# Altium schematic sheet Fan.SchDoc
size A4; SheetNumber: 4; SheetTotal: 8
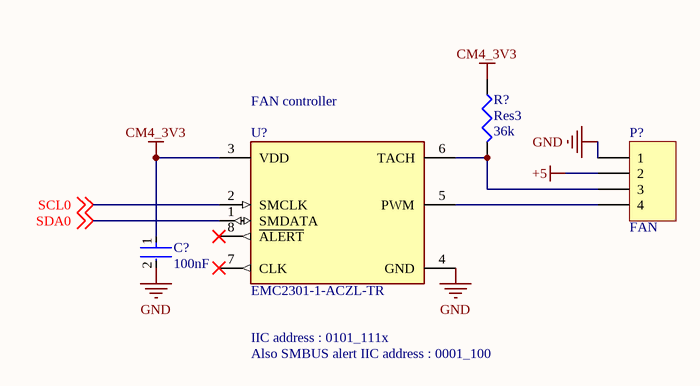
[diagram p0: Fan.SchDoc]

## Parts
C?  100nF  [FP-CC0603-DA-MFG]
P?  FAN  [HDR1X4]
R?  Res3  value 36k  [J1-0603]
U?  EMC2301-1-ACZL-TR  [FP-MO-8-TSSOP-3x3-IPC_C]

## Nets
+5: P?.2
CM4_3V3: C?.1 R?.1 U?.3(VDD)
GND: C?.2 P?.1 U?.4(GND)
SCL0: U?.2(SMCLK) ; off-sheet SCL0
SDA0: U?.1(SMDATA) ; off-sheet SDA0
NetP?_3: P?.3 R?.2 U?.6(TACH)
NetP?_4: P?.4 U?.5(PWM)

Not connected (* = marked no-connect by the designer): U? 7(CLK)* 8(~{ALERT})*

## Notes on the sheet
- (near U?) FAN controller
- IIC address : 0101_111x
- Also SMBUS alert IIC address : 0001_100
- Title:
- Author:
- Approved:
- Size:
- Date:
- Git Hash:
- A4
- Prj:
- SW Version:
- Variant:
- Edited:
- CONFIDENTIAL
- File:

## Library data of the parts
C? = CMP-03422-000924-1: CAP CER 1UF 16V X7R 0603; Manufacturer: YAGEO; Manufacturer Part Number: CC0603KRX7R7BB105; Tolerance: 0.1; Temperature Coefficient: 15%; Material: Ceramic; Package: CC0603-DA; RoHS: TRUE; Device Class L2: Capacitors; Temperature Characteristic: X7R; Temperature: -55°C to +125°C; Temperature Range Low: -55°C; Automotive: No; ComponentLink2Description: Datasheet; Value: 1 uF; Lead Free: Yes; Capacitance: 1 uF; ComponentLink2URL: http://www.yageo.com/documents/recent/UPY-GPHC_X7R_6.3V-to-50V_18.pdf; Device Class L1: Passive Components; Voltage: 16 V; Octopart: https://octopart.com/cc0603krx7r7bb105-yageo-42271928; Category: Cap; Digikey Description: CAP CER 1UF 16V X7R 0603; Footprint Url: http://www.yageo.com/exep/pages/download/literatures/UPY-C_GEN_24.pdf; Height: 0.9mm; Voltage Rating: 16 V; Temperature Range High: +125°C; Mouser Description: Multilayer Ceramic Capacitor, CC Series, 1 - F, - 10%, X7R, 16 V, 0603 [1608 Metric]; Device Class L3: Ceramic Capacitors
P? = Header 4: Header, 4-Pin; LatestRevisionDate: 17-Jul-2002; LatestRevisionNote: Re-released for DXP Platform.; Publisher: Altium Limited
R? = Res3: Resistor; Published: 8-Jun-2000; LatestRevisionDate: 29-May-2009; LatestRevisionNote: IPC-7351 Footprint Added.; PackageReference: J1-0603; Publisher: Altium Limited; PackageDescription: Chip Resistor
U? = CMP-06322-000001-1: IC MOTOR DRIVER 3V-3.6V 8MSOP; Interface: PWM; Min Supply Voltage: 3V; Max Supply Voltage (DC): 3.6V; Operating Supply Current: 350uA; Output Type: Digital; Operating Supply Voltage: 3.3V; Min Supply Voltage (DC): 3V; Min Operating Temperature: -40°C; Number of Pins: 8; Series: -; Max Operating Temperature: 125°C; Case/Package: MSOP; Lead Free: Lead Free; Packaging: Tape and Reel; Package Quantity: 1; Mount: Surface Mount; Max Supply Voltage: 3.6V